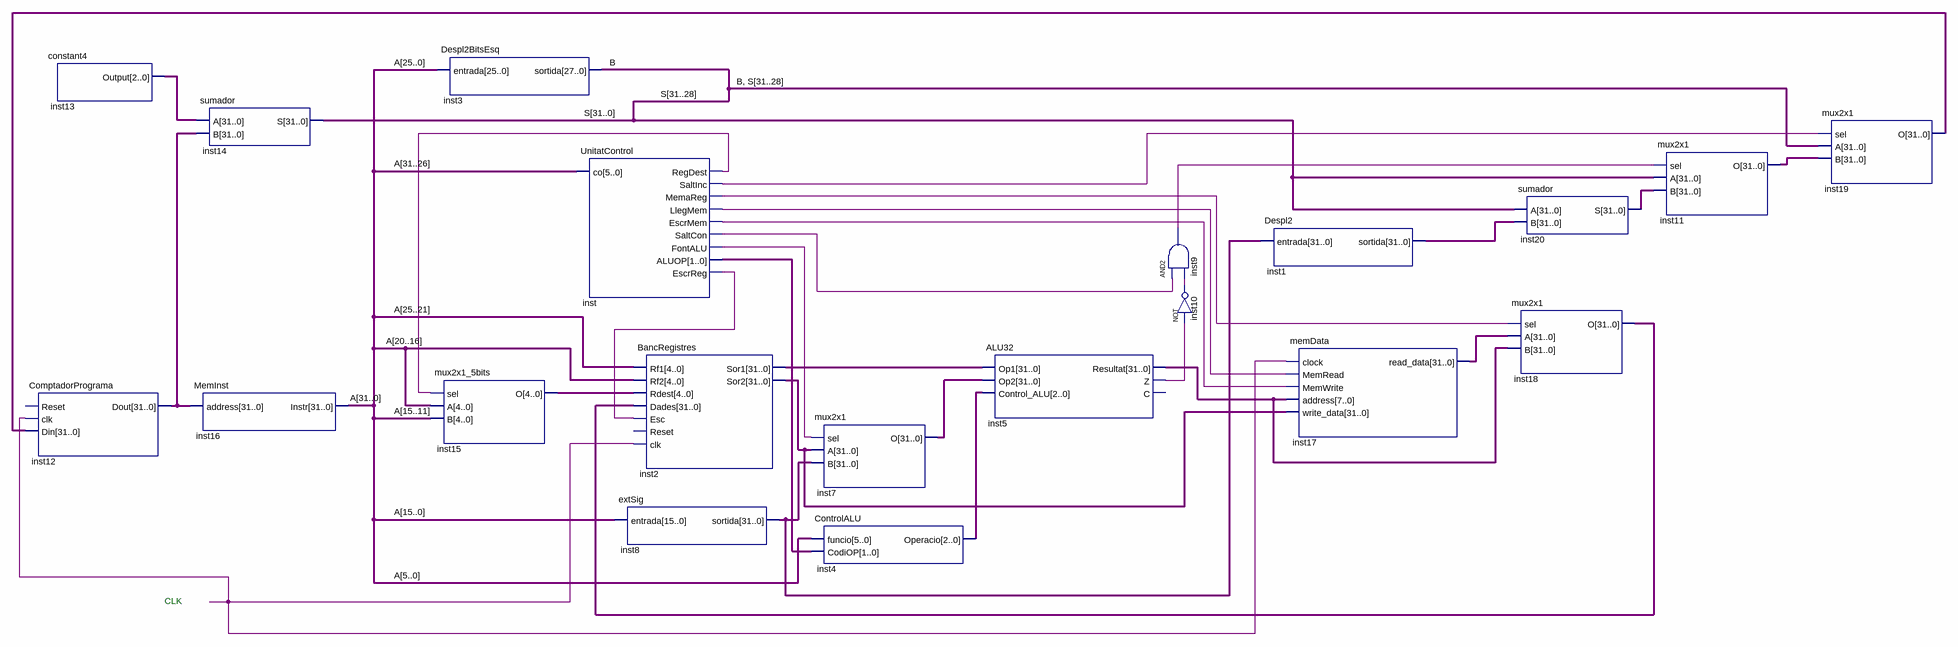
[diagram p0: schematic sheet]
// Quartus schematic microprocessador.bdf as structural Verilog: 20 symbols, 0 pins
module microprocessador (
);

  wire B, inst5_z, inst9_out, inst10_out, inst_escrmem, inst_escrreg, inst_fontalu, inst_llegmem,
       inst_memareg, inst_regdest, inst_saltcon, inst_saltinc, undriven;
  wire [1:0] inst_aluop;
  wire [2:0] inst4_operacio;
  wire [4:0] inst15_o;
  wire [31:0] A, inst1_sortida, inst2_sor1, inst2_sor2, inst5_resultat, inst7_o, inst8_sortida, inst11_o,
       inst12_dout, inst13_output, inst17_read_data, inst18_o, inst19_o, inst20_s, S;

  constant4 inst13 (.Output(inst13_output));
  ComptadorPrograma inst12 (.clk(undriven), .Din(inst19_o), .Dout(inst12_dout));  // open: Reset
  sumador inst14 (.A(inst13_output), .B(inst12_dout), .S(S));
  MemInst inst16 (.address(inst12_dout), .Instr(A));
  Despl2BitsEsq inst3 (.entrada(A[25:0]), .sortida(B));
  mux2x1_5bits inst15 (.sel(inst_regdest), .A(A[20:16]), .B(A[15:11]), .O(inst15_o));
  UnitatControl inst (
    .co(A[31:26]), .RegDest(inst_regdest), .SaltInc(inst_saltinc), .MemaReg(inst_memareg),
    .LlegMem(inst_llegmem), .EscrMem(inst_escrmem), .SaltCon(inst_saltcon), .FontALU(inst_fontalu),
    .ALUOP(inst_aluop), .EscrReg(inst_escrreg));
  extSig inst8 (.entrada(A[15:0]), .sortida(inst8_sortida));
  BancRegistres inst2 (
    .Rf1(A[25:21]), .Rf2(A[20:16]), .Rdest(inst15_o), .Dades(inst18_o), .Esc(inst_escrreg), .clk(undriven),
    .Sor1(inst2_sor1), .Sor2(inst2_sor2));  // open: Reset
  mux2x1 inst7 (.sel(inst_fontalu), .A(inst2_sor2), .B(inst8_sortida), .O(inst7_o));
  ControlALU inst4 (.funcio(A[5:0]), .CodiOP(inst_aluop), .Operacio(inst4_operacio));
  ALU32 inst5 (
    .Op1(inst2_sor1), .Op2(inst7_o), .Control_ALU(inst4_operacio), .Resultat(inst5_resultat), .Z(inst5_z));  // open: C
  and inst9 (inst9_out, inst_saltcon, inst10_out);
  not inst10 (inst10_out, inst5_z);
  Despl2 inst1 (.entrada(inst8_sortida), .sortida(inst1_sortida));
  memData inst17 (
    .clock(undriven), .MemRead(inst_llegmem), .MemWrite(inst_escrmem), .address(inst5_resultat),
    .write_data(inst2_sor2), .read_data(inst17_read_data));
  sumador inst20 (.A(S), .B(inst1_sortida), .S(inst20_s));
  mux2x1 inst18 (.sel(inst_memareg), .A(inst17_read_data), .B(inst5_resultat), .O(inst18_o));
  mux2x1 inst11 (.sel(inst9_out), .A(S), .B(inst20_s), .O(inst11_o));
  mux2x1 inst19 (.sel(inst_saltinc), .A({B, S[31:28]}), .B(inst11_o), .O(inst19_o));

  // Notes on the sheet:
  //   CLK
endmodule
